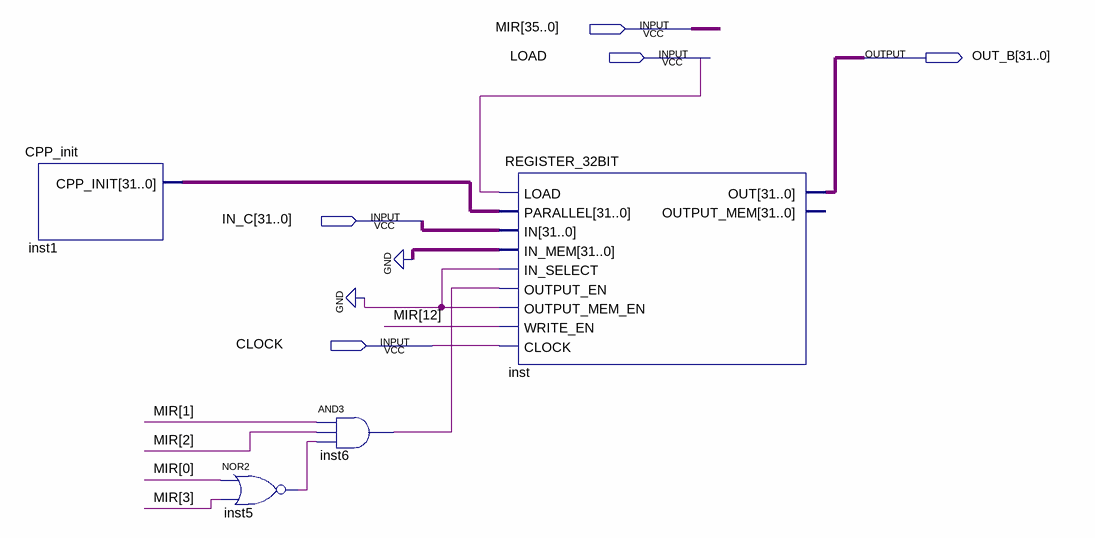
[diagram p0: schematic sheet]
// Quartus schematic CPP.bdf as structural Verilog: 4 symbols, 5 pins
module CPP (
  input  [35:0] MIR,
  input  LOAD,
  input  [31:0] IN_C,
  input  CLOCK,
  output [31:0] OUT_B
);

  wire inst5_out, inst6_out;
  wire [31:0] inst1_cpp_init;

  CPP_init inst1 (.CPP_INIT(inst1_cpp_init));
  nor inst5 (inst5_out, MIR[0], MIR[3]);
  and inst6 (inst6_out, MIR[1], MIR[2], inst5_out);
  REGISTER_32BIT inst (
    .LOAD(LOAD), .PARALLEL(inst1_cpp_init), .IN(IN_C), .IN_MEM({32{1'b0}}), .IN_SELECT(1'b0),
    .OUTPUT_EN(inst6_out), .OUTPUT_MEM_EN(1'b0), .WRITE_EN(MIR[12]), .CLOCK(CLOCK), .OUT(OUT_B));  // open: OUTPUT_MEM
endmodule
